# EAGLE design rev2 (EAGLE 9.6.2)
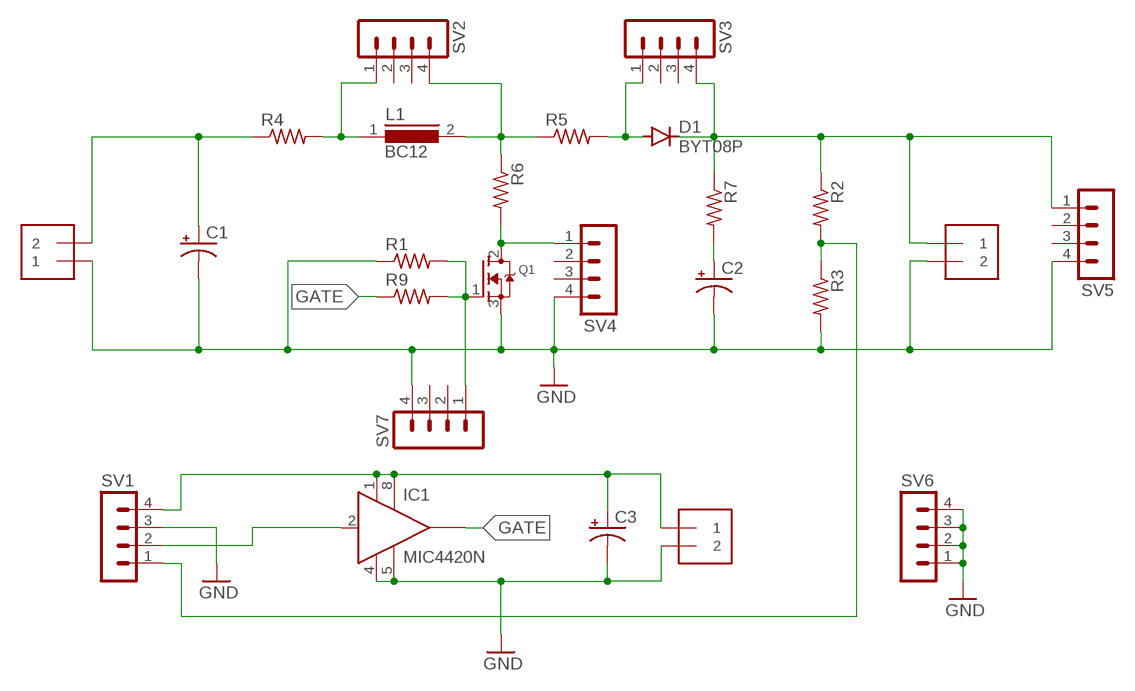
[diagram p0: schematic, sheet 1]

## Parts
C1  CPOL-USE7.5-18  [E7,5-18]
C2  CPOL-USE7.5-18  [E7,5-18]
C3  CPOL-USE2.5-6  [E2,5-6]
D1  BYT08P  [TO220ACS]
IC1  MIC4420N  [DIL08]
J1  1X2-3.5MM  [1X2-3.5MM]
J2  1X2-3.5MM  [1X2-3.5MM]
J3  1X2-3.5MM  [1X2-3.5MM]
L1  BC12  [BC12]
Q1  MOSFET-NGDS_TO220V  [TO220V]
R1  R-US_0207/7  [0207/7]
R2  R-US_0207/7  [0207/7]
R3  R-US_0207/7  [0207/7]
R4  R-US_0613/15  [P0613/15]
R5  R-US_0613/15  [P0613/15]
R6  R-US_0613/15  [P0613/15]
R7  R-US_0613/15  [P0613/15]
R9  R-US_0309/12  [0309/12]
SV1  MA04-1  [MA04-1]
SV2  MA04-1  [MA04-1]
SV3  MA04-1  [MA04-1]
SV4  MA04-1  [MA04-1]
SV5  MA04-1  [MA04-1]
SV6  MA04-1  [MA04-1]
SV7  MA04-1  [MA04-1]

## Nets
GATE: IC1.6(OUT) R9.1
GND: C1.- C2.- C3.- IC1.4(GND) IC1.5(GND1) J1.1 J2.2 J3.2 Q1.3(S) R1.1 R3.2 SV1.3 SV4.4 SV5.4 SV6.1 SV6.2 SV6.3 SV6.4 SV7.4
N$1: C1.+ J1.2 R4.1
N$2: L1.1 R4.2 SV2.1
N$3: L1.2 R5.1 R6.1 SV2.4
N$4: D1.A R5.2 SV3.1
N$5: C3.+ IC1.1(VS) IC1.8(VS1) J3.1 SV1.4
N$6: Q1.2(D) R6.2 SV4.1
N$7: Q1.1(G) R1.2 R9.2 SV7.1
N$9: C2.+ R7.2
N$10: D1.C J2.1 R2.1 R7.1 SV3.4 SV5.1
N$11: R2.2 R3.1 SV1.1
N$13: IC1.2(IN) SV1.2
Unconnected: IC1.7(OUT) SV2.2 SV2.3 SV3.2 SV3.3 SV4.2 SV4.3 SV5.2 SV5.3 SV7.2 SV7.3

## Library data of the parts
C1-C3 = rcl:CPOL-US: POLARIZED CAPACITOR, American symbol; SPICEPREFIX: C
D1 = diode:BYT08P: DIODE ultra fast
IC1 = transistor-power:MIC4420: 6A-Peak Low-Side MOSFET Driver Bipolar/CMOS/DMOS Process http://www.micrel.com/_PDF/mic4420.pdf
J1-J3 = adafruit:1X2: 3.5mm Terminal block http://www.ladyada.net/library/pcb/eaglelibrary.html
L1 = inductors:BC12: INDUCTOR; SPICEPREFIX: L
Q1 = adafruit:MOSFET-N: N-Channel Mosfet 2N7002E - 60V 260mA SOT23 [Digikey: 2N7002ET1GOSTR-ND] - REEL BSH103 - 30V 850mA SOT23 [Digikey: 568-5013-1-ND]
R1-R7 R9 = adafruit:R-US_: RESISTOR, American symbol
SV1-SV7 = con-lstb:MA04-1: PIN HEADER; OC_FARNELL: unknown; OC_NEWARK: unknown

## Board
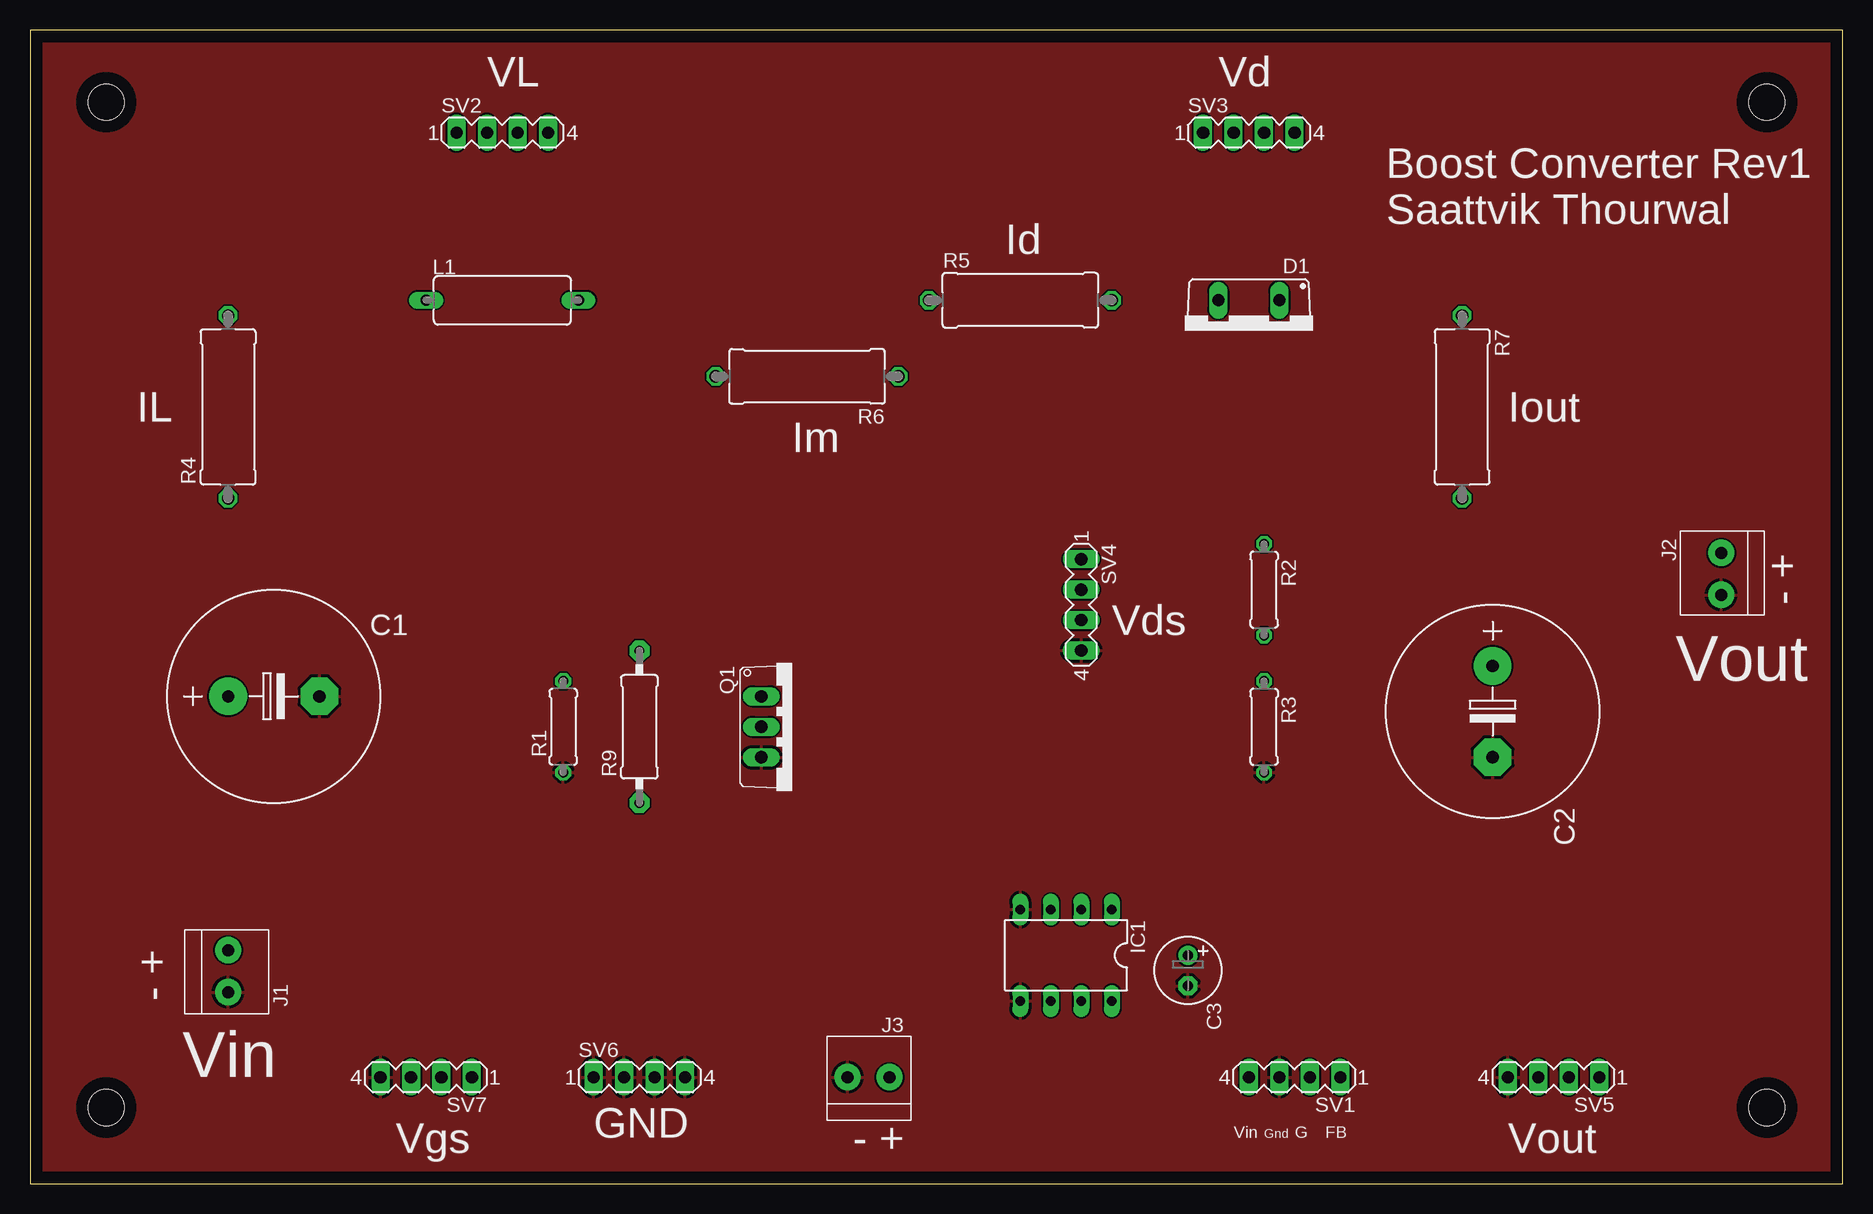
[diagram p1: board, top side]
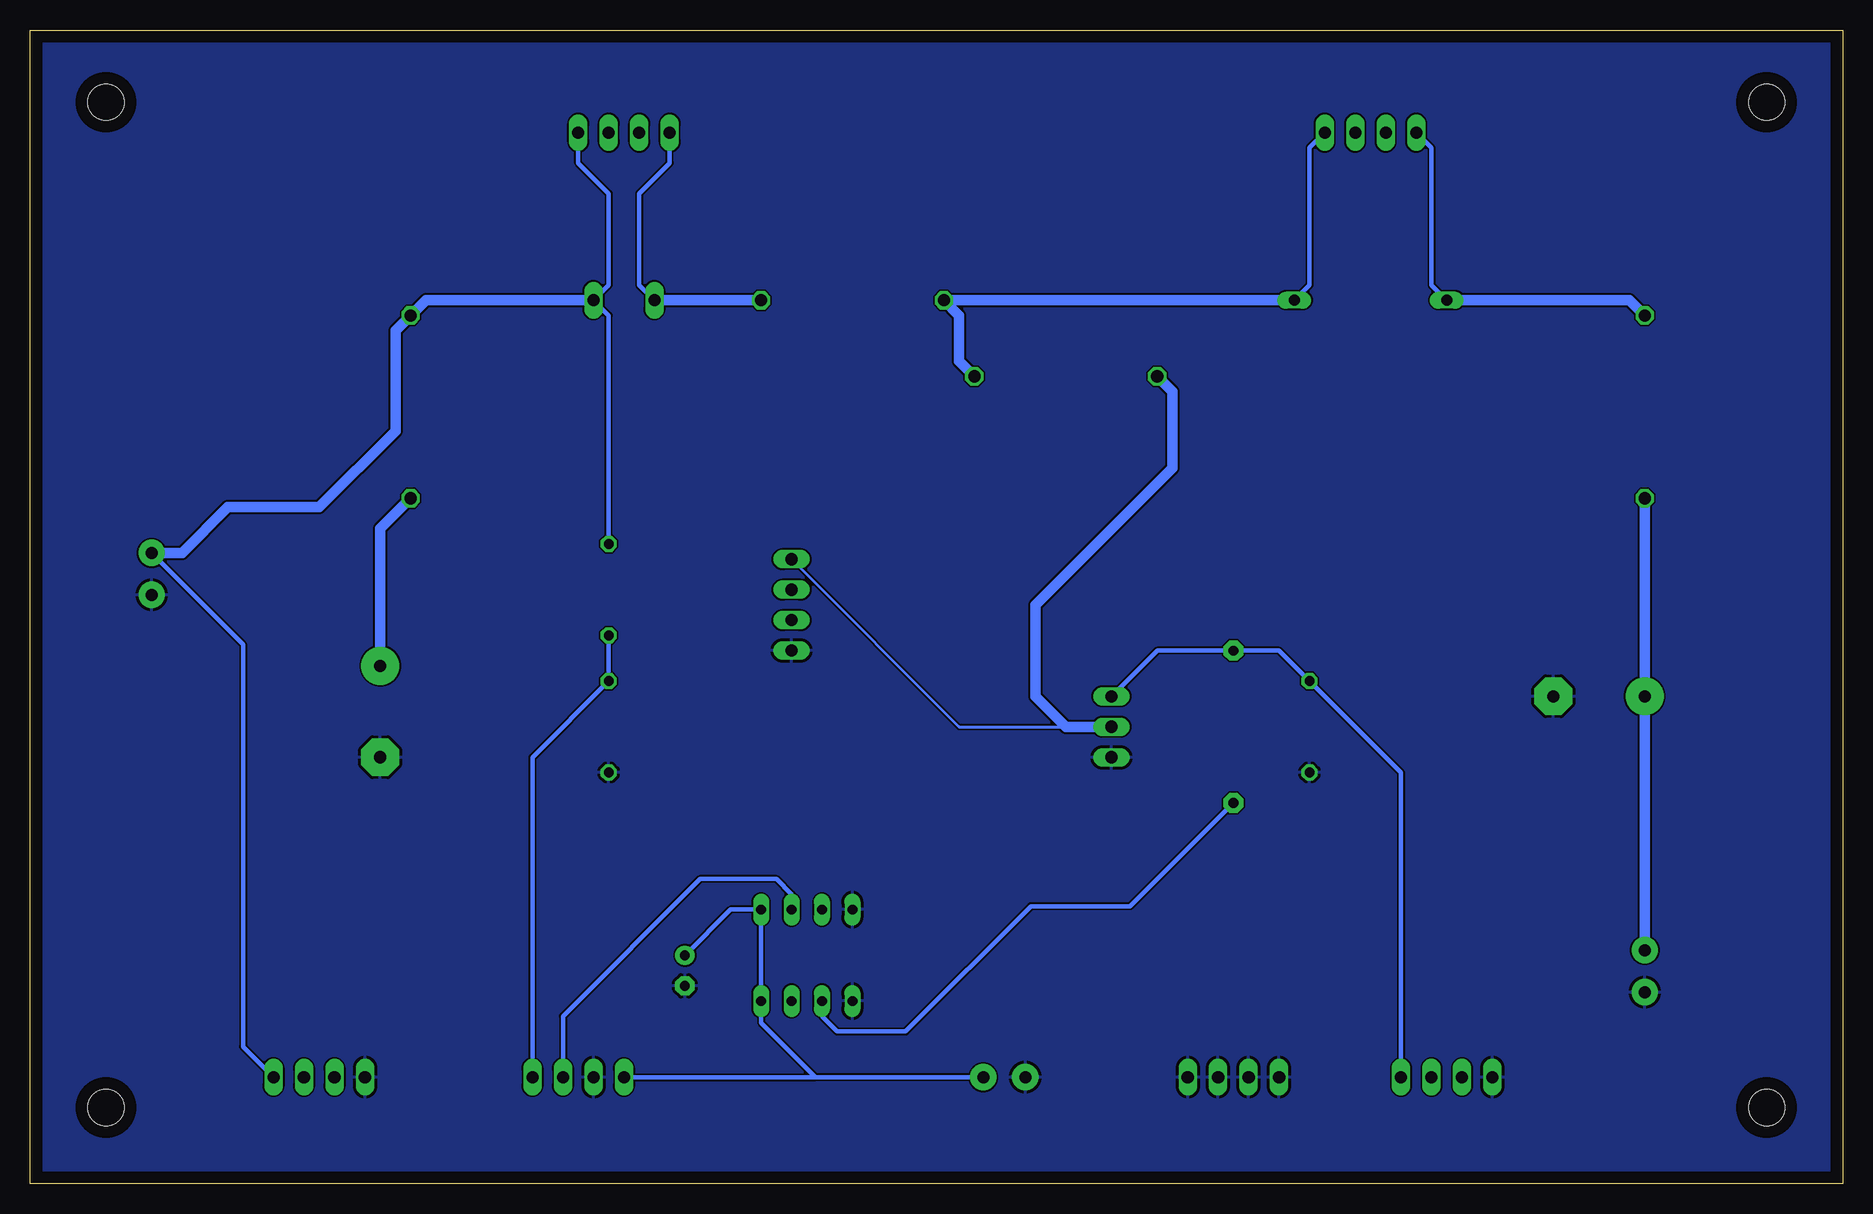
[diagram p2: board, bottom side, seen from below]

Size 151.11 x 96.19 mm. Coordinates in mm from the lower left corner, seen from the top.
Outline: 0,0 151.11,0 151.11,96.19 0,96.19 0,0
Copper layers (1*16): Top 0.035mm / dielectric 1.5mm / Bottom 0.035mm
Design rules "default": minimum track width 6mil, minimum drill 0.35mm, track to track 6mil, track to pad 6mil, pad to pad 6mil, via to via 6mil, smd to smd 6mil, copper to edge 40mil, drill to drill 6mil, minimum pad ring 10mil, minimum via ring 8mil, stop-mask expansion 4mil, vias tented up to drill 0mil, thermal gap 10mil
Holes 3 mm at 6.35,90.17 144.78,90.17 144.78,6.35 6.35,6.35

### Footprints (pad centres in the part's own frame; a part is rotated, then mirrored left to right if it is on the bottom)
E7,5-18 = drill 1.016 pad 3.15: + -3.81,0 | drill 1.016 pad 3.15 octagon: - 3.81,0
E2,5-6 = drill 0.813 pad 1.6: + -1.27,0 | drill 0.813 pad 1.6 octagon: - 1.27,0
TO220ACS = drill 1.016 long: A 2.54,-2.54; C -2.54,-2.54
DIL08 = drill 0.813 long: 1 -3.81,-3.81; 2 -1.27,-3.81; 3 1.27,-3.81; 4 3.81,-3.81; 5 3.81,3.81; 6 1.27,3.81; 7 -1.27,3.81; 8 -3.81,3.81
1X2-3.5MM = drill 1 pad 2.184: 1 1.8,0; 2 -1.7,0
BC12 = drill 0.914 long: 1 -6.35,0; 2 6.35,0
TO220V = drill 1.016 long: 1 -2.54,-2.54; 2 0,-2.54; 3 2.54,-2.54
0207/7 = drill 0.813 octagon: 1 -3.81,0; 2 3.81,0
P0613/15 = drill 1.016 octagon: 1 -7.62,0; 2 7.62,0
0309/12 = drill 0.813 pad 1.676 octagon: 1 -6.35,0; 2 6.35,0
MA04-1 = drill 1.016 long: 1 -3.81,0; 2 -1.27,0; 3 1.27,0; 4 3.81,0

### Placement (x,y rotation side)
C1  20.32,40.64 0 top
C2  121.92,39.37 270 top
C3  96.52,17.78 270 top
D1  101.6,71.12 180 top
IC1  86.36,19.05 180 top
J1  16.51,17.78 270 top
J2  140.97,50.8 90 top
J3  69.85,8.89 0 top
L1  39.37,73.66 0 top
Q1  63.5,38.1 270 top
R1  44.45,38.1 90 top
R2  102.87,49.53 270 top
R3  102.87,38.1 270 top
R4  16.51,64.77 90 top
R5  82.55,73.66 0 top
R6  64.77,67.31 180 top
R7  119.38,64.77 270 top
R9  50.8,38.1 90 top
SV1  105.41,8.89 180 top
SV2  39.37,87.63 0 top
SV3  101.6,87.63 0 top
SV4  87.63,48.26 270 top
SV5  127,8.89 180 top
SV6  50.8,8.89 0 top
SV7  33.02,8.89 180 top

### Tracks (layer width: path | path; a pad name or v marks a point on that pad's centre or on a via)
GATE
  Bottom 0.381: IC1.6 85.09,13.97 83.82,12.7 78.12,12.7 67.68,23.14 59.41,23.14 R9.1
GND
  pour Top: -2.54,99.06 153.67,99.06 153.67,-2.54 -2.54,-2.54
  pour Bottom: -2.54,99.06 153.67,99.06 153.67,-2.54 -2.54,-2.54
N$1
  Bottom 0.889: J1.2 C1.+ R4.1
N$2
  Bottom 0.381: L1.1 34.29,74.93 34.29,86.36 SV2.1
  Bottom 0.889: L1.1 17.78,73.66 R4.2
N$3
  Bottom 0.381: L1.2 44.45,74.93 44.45,86.36 SV2.4
  Bottom 0.889: L1.2 R5.1 73.66,72.39 73.66,68.58 R6.1
N$4
  Bottom 0.381: D1.A 100.33,74.93 100.33,82.55 97.79,85.09 SV3.1
  Bottom 0.889: R5.2 D1.A
N$5
  Bottom 0.381: C3.+ 92.71,22.86 IC1.1 IC1.8 90.17,13.44 85.62,8.89 | J3.1 85.62,8.89 | SV1.4 85.62,8.89
N$6
  Bottom 0.254: SV4.1 73.66,38.1 64.77,38.1
  Bottom 0.889: R6.2 55.88,66.04 55.88,59.69 67.31,48.26 67.31,40.64 64.77,38.1 Q1.2
N$7
  Bottom 0.381: SV7.1 36.83,34.29 R1.2 46.99,44.45 R9.2 57.15,44.45 Q1.1
N$9
  Bottom 0.889: R7.2 121.92,54.61 C2.+
N$10
  Bottom 0.381: SV3.4 105.41,85.09 102.87,82.55 102.87,74.93 D1.C 102.87,72.39 R2.1 | SV5.1 133.35,11.43 133.35,44.98 J2.1
  Bottom 0.889: D1.C 118.11,73.66 R7.1 120.65,71.12 120.65,62.76 127,56.41 134.62,56.41 138.43,52.6 J2.1
N$11
  Bottom 0.381: R2.2 R3.1 109.22,35.56 SV1.1
N$13
  Bottom 0.381: IC1.2 87.63,24.13 88.9,25.4 95.25,25.4 106.68,13.97 SV1.2

### Text on the board
tNames: VL | Vd | Boost Converter Rev1 / Saattvik Thourwal | Id | IL | Iout | Im | - + | Vds | Vout | - + | Vin | GND | Vin | Gnd | G | FB | Vgs | - + | Vout